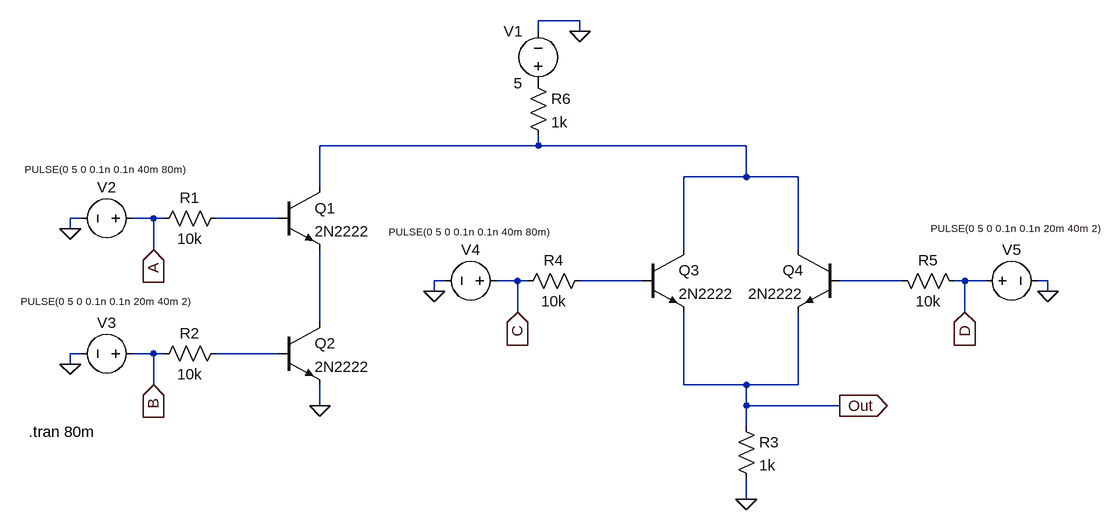
[diagram p0: schematic xor_gate.asc]
xor_gate.asc, the LTspice schematic file:
Version 4
SHEET 1 1560 680
WIRE 752 -224 688 -224
WIRE 688 -208 688 -224
WIRE 752 -208 752 -224
WIRE 688 -32 688 -48
WIRE 688 -32 352 -32
WIRE 1008 -32 688 -32
WIRE 1008 16 1008 -32
WIRE 1008 16 912 16
WIRE 1088 16 1008 16
WIRE 352 32 352 -32
WIRE -16 80 -32 80
WIRE 96 80 64 80
WIRE 112 80 96 80
WIRE 288 80 192 80
WIRE -32 96 -32 80
WIRE 96 128 96 80
WIRE 912 128 912 16
WIRE 1088 128 1088 16
WIRE 544 176 528 176
WIRE 656 176 624 176
WIRE 672 176 656 176
WIRE 848 176 752 176
WIRE 1248 176 1152 176
WIRE 1344 176 1328 176
WIRE 1376 176 1344 176
WIRE 1472 176 1456 176
WIRE 528 192 528 176
WIRE 1472 192 1472 176
WIRE 656 224 656 176
WIRE 1344 224 1344 176
WIRE 352 240 352 128
WIRE -16 288 -32 288
WIRE 96 288 64 288
WIRE 112 288 96 288
WIRE 288 288 192 288
WIRE -32 304 -32 288
WIRE 96 336 96 288
WIRE 912 336 912 224
WIRE 1008 336 912 336
WIRE 1088 336 1088 224
WIRE 1088 336 1008 336
WIRE 352 368 352 336
WIRE 1008 368 1008 336
WIRE 1152 368 1008 368
WIRE 1008 400 1008 368
WIRE 1008 512 1008 480
FLAG 1008 512 0
FLAG 752 -208 0
FLAG -32 96 0
FLAG -32 304 0
FLAG 1152 368 Out
IOPIN 1152 368 Out
FLAG 96 128 A
IOPIN 96 128 In
FLAG 96 336 B
IOPIN 96 336 In
FLAG 352 368 0
FLAG 528 192 0
FLAG 656 224 C
IOPIN 656 224 In
FLAG 1472 192 0
FLAG 1344 224 D
IOPIN 1344 224 In
SYMBOL npn 288 32 R0
SYMATTR InstName Q1
SYMATTR Value 2N2222
SYMBOL npn 288 240 R0
SYMATTR InstName Q2
SYMATTR Value 2N2222
SYMBOL voltage 688 -112 R180
WINDOW 0 24 96 Left 2
WINDOW 3 24 16 Left 2
WINDOW 123 0 0 Left 0
WINDOW 39 0 0 Left 0
SYMATTR InstName V1
SYMATTR Value 5
SYMBOL res 208 64 R90
WINDOW 0 0 56 VBottom 2
WINDOW 3 32 56 VTop 2
SYMATTR InstName R1
SYMATTR Value 10k
SYMBOL res 208 272 R90
WINDOW 0 0 56 VBottom 2
WINDOW 3 32 56 VTop 2
SYMATTR InstName R2
SYMATTR Value 10k
SYMBOL voltage 80 80 R90
WINDOW 0 -32 56 VBottom 2
WINDOW 3 -86 61 VTop 1
WINDOW 123 0 0 Left 0
WINDOW 39 0 0 Left 0
SYMATTR InstName V2
SYMATTR Value PULSE(0 5 0 0.1n 0.1n 40m 80m)
SYMBOL voltage 80 288 R90
WINDOW 0 -32 56 VBottom 2
WINDOW 3 -91 60 VTop 1
WINDOW 123 0 0 Left 0
WINDOW 39 0 0 Left 0
SYMATTR InstName V3
SYMATTR Value PULSE(0 5 0 0.1n 0.1n 20m 40m 2)
SYMBOL res 992 384 R0
SYMATTR InstName R3
SYMATTR Value 1k
SYMBOL npn 848 128 R0
SYMATTR InstName Q3
SYMATTR Value 2N2222
SYMBOL res 768 160 R90
WINDOW 0 0 56 VBottom 2
WINDOW 3 32 56 VTop 2
SYMATTR InstName R4
SYMATTR Value 10k
SYMBOL voltage 640 176 R90
WINDOW 0 -32 56 VBottom 2
WINDOW 3 -86 61 VTop 1
WINDOW 123 0 0 Left 0
WINDOW 39 0 0 Left 0
SYMATTR InstName V4
SYMATTR Value PULSE(0 5 0 0.1n 0.1n 40m 80m)
SYMBOL npn 1152 128 M0
SYMATTR InstName Q4
SYMATTR Value 2N2222
SYMBOL res 1232 160 M90
WINDOW 0 0 56 VBottom 2
WINDOW 3 32 56 VTop 2
SYMATTR InstName R5
SYMATTR Value 10k
SYMBOL voltage 1360 176 M90
WINDOW 0 -32 56 VBottom 2
WINDOW 3 -91 60 VTop 1
WINDOW 123 0 0 Left 0
WINDOW 39 0 0 Left 0
SYMATTR InstName V5
SYMATTR Value PULSE(0 5 0 0.1n 0.1n 20m 40m 2)
SYMBOL res 672 -144 R0
SYMATTR InstName R6
SYMATTR Value 1k
TEXT -96 408 Left 2 !.tran 80m

The netlist it stands for:
* xor_gate.asc
Q1 N001 N002 N005 0 2N2222
Q2 N005 N006 0 0 2N2222
V1 P001 0 5
R1 N002 A 10k
R2 N006 B 10k
V2 A 0 PULSE(0 5 0 0.1n 0.1n 40m 80m)
V3 B 0 PULSE(0 5 0 0.1n 0.1n 20m 40m 2)
R3 Out 0 1k
Q3 N001 N003 Out 0 2N2222
R4 N003 C 10k
V4 C 0 PULSE(0 5 0 0.1n 0.1n 40m 80m)
Q4 N001 N004 Out 0 2N2222
R5 N004 D 10k
V5 D 0 PULSE(0 5 0 0.1n 0.1n 20m 40m 2)
R6 P001 N001 1k
.model NPN NPN
.model PNP PNP
.lib standard.bjt
.tran 80m
.backanno
.end

* Results of the author's LTspice run, read from the files saved beside the schematic
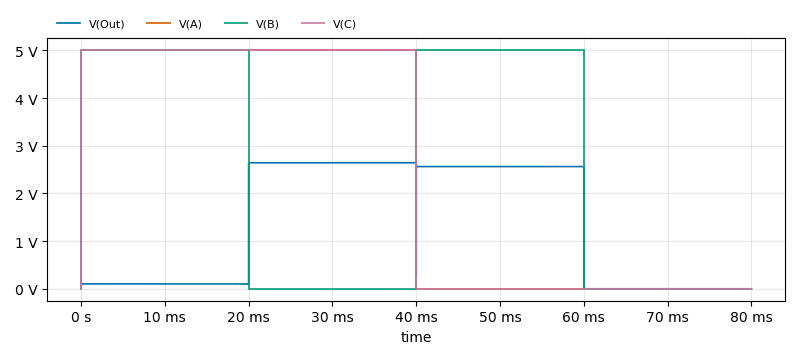
[diagram p1: Transient Analysis of xor_gate.asc, plotted from the saved traces]
* Transient Analysis, 1 run:
*   V(Out): min -809.2 µV, max 2.653 V, average 1.327 V, rms 1.841 V, last 0 V
*   V(A): min 0 V, max 5 V, average 2.5 V, rms 3.536 V, last 0 V
*   V(B): min 0 V, max 5 V, average 2.5 V, rms 3.536 V, last 0 V
*   V(C): min 0 V, max 5 V, average 2.5 V, rms 3.536 V, last 0 V